# EAGLE design gps-breakout-mk-1.3 (EAGLE 7.5.0)
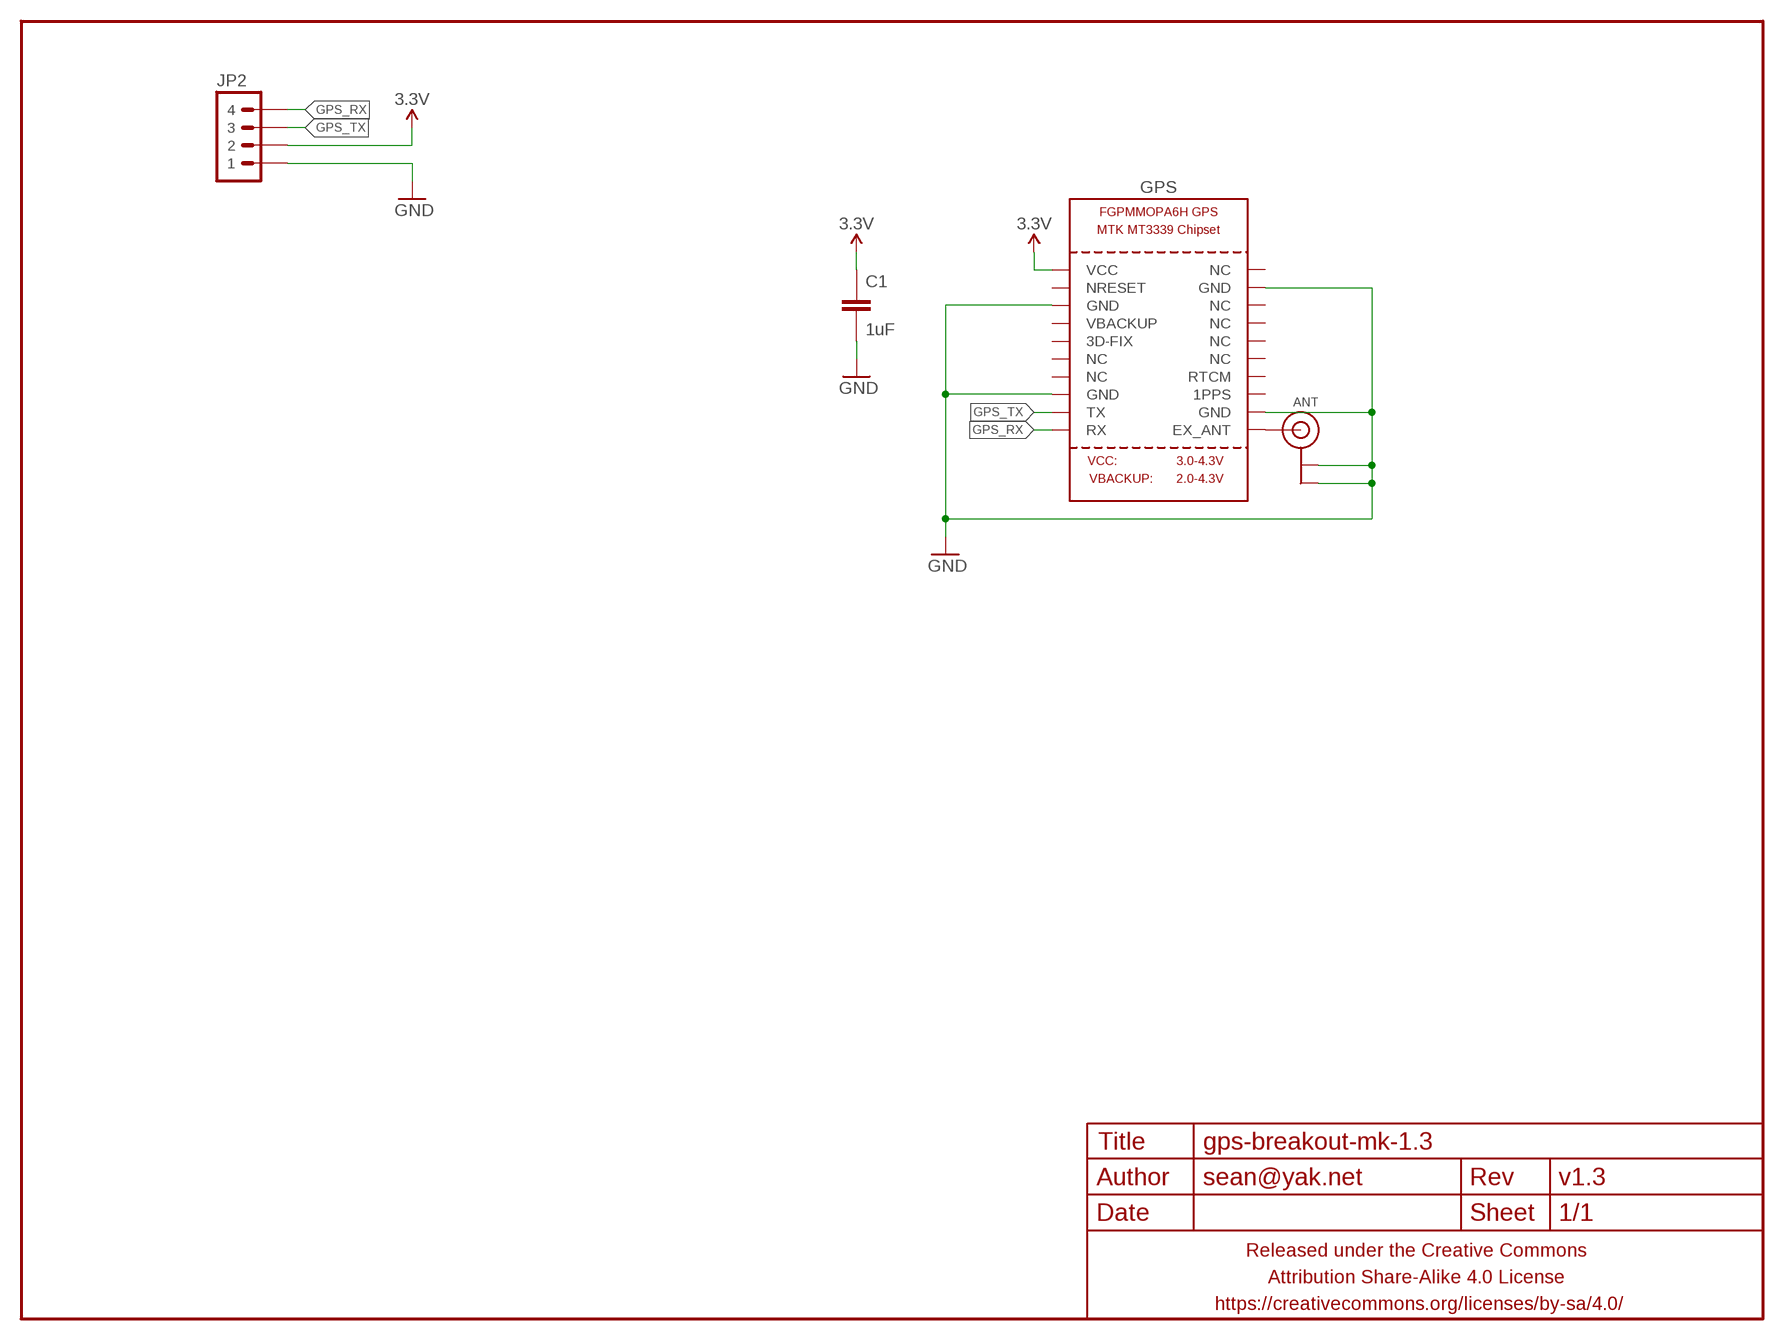
[diagram p0: schematic, sheet 1]

## Parts
ANT  ANTENNAUFL  [U.FL]
C1  1uF  CAPACITOR-CERAMICC0603-TIGHTER  [C0603-TIGHTER]
FRAME1  FRAME-LETTERNO_PACKAGE  [DUMMY]
GPS  GPS_FGPMMOPA6H  [FGPMMOPA6H]
JP2  M04SMD-FEMALE  [1X04-SMD-FEMALE-RA]

## Nets
3.3V: C1.1 GPS.P$1(VCC) JP2.P$2
GND: ANT.1(GND) ANT.2(GND) C1.2 GPS.P$3(GND) GPS.P$8(GND) GPS.P$12(GND) GPS.P$19(GND) JP2.P$1
GPS_RX: GPS.P$10(RX) JP2.P$4
GPS_TX: GPS.P$9(TX) JP2.P$3
N$1: ANT.3(SIGNAL) GPS.P$11(EX_ANT)
Unconnected: GPS.P$2(NRESET) GPS.P$4(VBACKUP) GPS.P$5(3D-FIX) GPS.P$6(NC) GPS.P$7(NC) GPS.P$13(1PPS) GPS.P$14(RTCM) GPS.P$15(NC) GPS.P$16(NC) GPS.P$17(NC) GPS.P$18(NC) GPS.P$20(NC)

## Library data of the parts
ANT = a_parts:ANTENNA: U.FL Antenna Connector
C1 = a_parts:CAPACITOR-CERAMIC: CAPACITOR, European symbol
FRAME1 = a_parts:FRAME-LETTER: Schematic Frame Standard 8.5x11 US Letter frame; DESIGNER: sean@yak.net; VERSION: v1.3
GPS = a_parts:GPS_FGPMMOPA6H: GPS Module - MTK MT3339 Chipset, -165dBm sensitivity, 22 channels, 10Hz, auto-select external antenna options
JP2 = a_parts:M04: Header 4 Standard 4-pin 0.1" header. Use with straight break away headers (SKU : PRT-00116), right angle break away headers (PRT-00553), swiss pins (PRT-00743), machine pins (PRT-00117), and female headers (PRT-00115). Molex polarized connector foot print use with SKU : PRT-08231 with associated crimp pins and housings. 1MM SMD Version SKU: PRT-10208

## Board
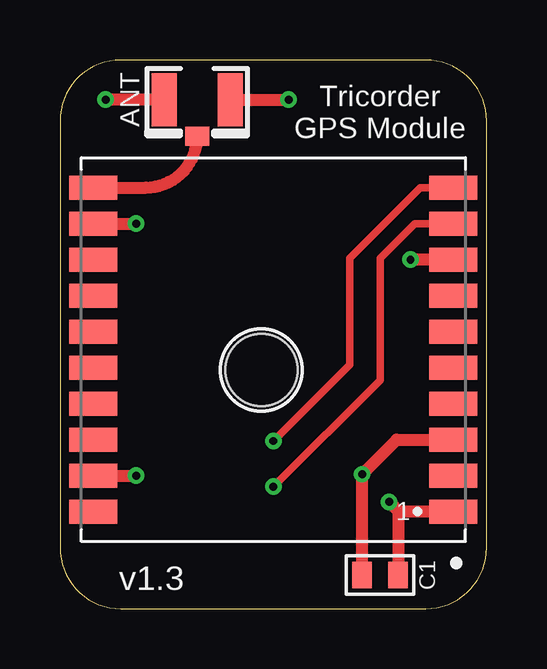
[diagram p1: board, top side]
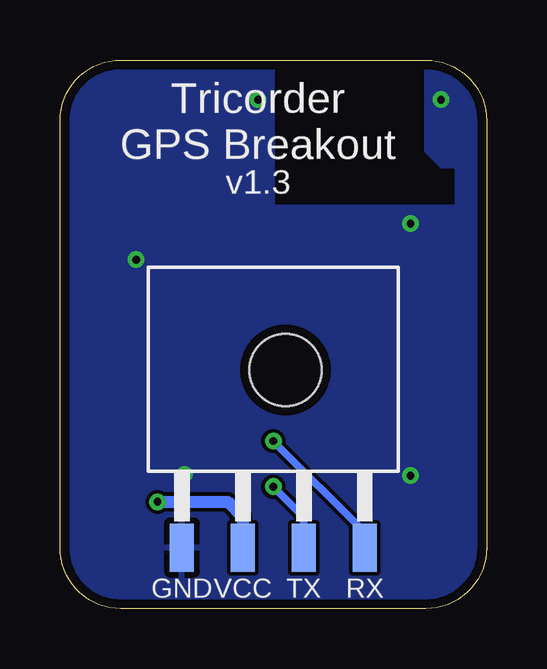
[diagram p2: board, bottom side, seen from below]

Size 17.78 x 22.86 mm. Coordinates in mm from the lower left corner, seen from the top.
Outline: 17.78,2.54 17.78,20.32 arc90 15.24,22.86 2.54,22.86 arc90 0,20.32 0,2.54 arc90 2.54,0 15.24,0 arc90 17.78,2.54
Copper layers (1*16): Top 0.0356mm / dielectric 1.5011mm / Bottom 0.0356mm
Design rules "LaenPCBOrder2": minimum track width 6mil, minimum drill 13mil, track to track 6mil, track to pad 6mil, pad to pad 6mil, via to via 6mil, smd to smd 6mil, copper to edge 15mil, drill to drill 6mil, minimum pad ring 7mil, minimum via ring 7mil, stop-mask expansion 3mil, vias tented up to drill 20mil, thermal gap 10mil

### Footprints (pad centres in the part's own frame; a part is rotated, then mirrored left to right if it is on the bottom)
U.FL = smd 2.2 x 1.05: 1 0,1.375; 2 0,-1.375 | smd 0.8 x 1: 3 1.525,0
C0603-TIGHTER = smd 0.8 x 1.1: 1 -0.75,0; 2 0.75,0
FGPMMOPA6H = smd 2 x 1: P$1 -7.5,6.75; P$2 -7.5,5.25; P$3 -7.5,3.75; P$4 -7.5,2.25; P$5 -7.5,0.75; P$6 -7.5,-0.75; P$7 -7.5,-2.25; P$8 -7.5,-3.75; P$9 -7.5,-5.25; P$10 -7.5,-6.75; P$11 7.5,-6.75; P$12 7.5,-5.25; P$13 7.5,-3.75; P$14 7.5,-2.25; P$15 7.5,-0.75; P$16 7.5,0.75; P$17 7.5,2.25; P$18 7.5,3.75; P$19 7.5,5.25; P$20 7.5,6.75 | hole 3: 0.5,0.85
1X04-SMD-FEMALE-RA = smd 1 x 2: P$1 -3.81,0; P$2 -1.27,0; P$3 1.27,0; P$4 3.81,0

### Placement (x,y rotation side)
ANT  5.71,21.21 270 top
C1  13.34,1.4 180 top
FRAME1  0,0 0 top
GPS  8.89,10.79 180 top
JP2  8.89,2.54 0 bottom

### Tracks (layer width: path | path; a pad name or v marks a point on that pad's centre or on a via)
3.3V  (via drill 0.33)
  Top 0.508: v13.72,4.45 14.1,4.06 | 14.1,4.06 C1.1 | GPS.P$1 14.12,4.04 14.1,4.06
  Bottom 0.508: v13.72,4.45 10.79,4.45 10.16,3.81 JP2.P$2
GND  (via drill 0.33)
  Top 0.508: C1.2 v12.59,5.6 14.03,7.04 GPS.P$3 | GPS.P$8 v14.61,14.54 | GPS.P$19 v3.17,5.54 | GPS.P$12 v3.17,16.05 | ANT.2 v1.91,21.21 | ANT.1 v9.53,21.21
  pour Bottom: 8.89,22.86 15.24,22.86 arc-90 17.78,20.32 17.78,2.54 arc-90 15.24,0 2.54,0 arc-90 0,2.54 0,22.86 2.54,22.86 2.54,19.05 1.91,18.41 1.27,18.41 1.27,16.76 8.89,16.76
GPS_RX  (via drill 0.33)
  Top 0.305: GPS.P$10 15.01,17.55 12.06,14.61 12.06,10.16 v8.89,6.99
  Bottom 0.305: JP2.P$4 5.08,3.17 v8.89,6.99
GPS_TX  (via drill 0.33)
  Top 0.305: GPS.P$9 14.78,16.05 13.34,14.61 13.34,9.53 v8.89,5.08
  Bottom 0.305: JP2.P$3 7.62,3.81 v8.89,5.08
N$1
  Top 0.508: GPS.P$11 3.58,17.55 arc90 ANT.3

### Text on the board
tPlace: Tricorder / GPS Module | 1
bPlace: Tricorder / GPS Breakout
bNames: RX | TX | VCC | GND